# Altium project SAM_Prototype_0.PrjPcb
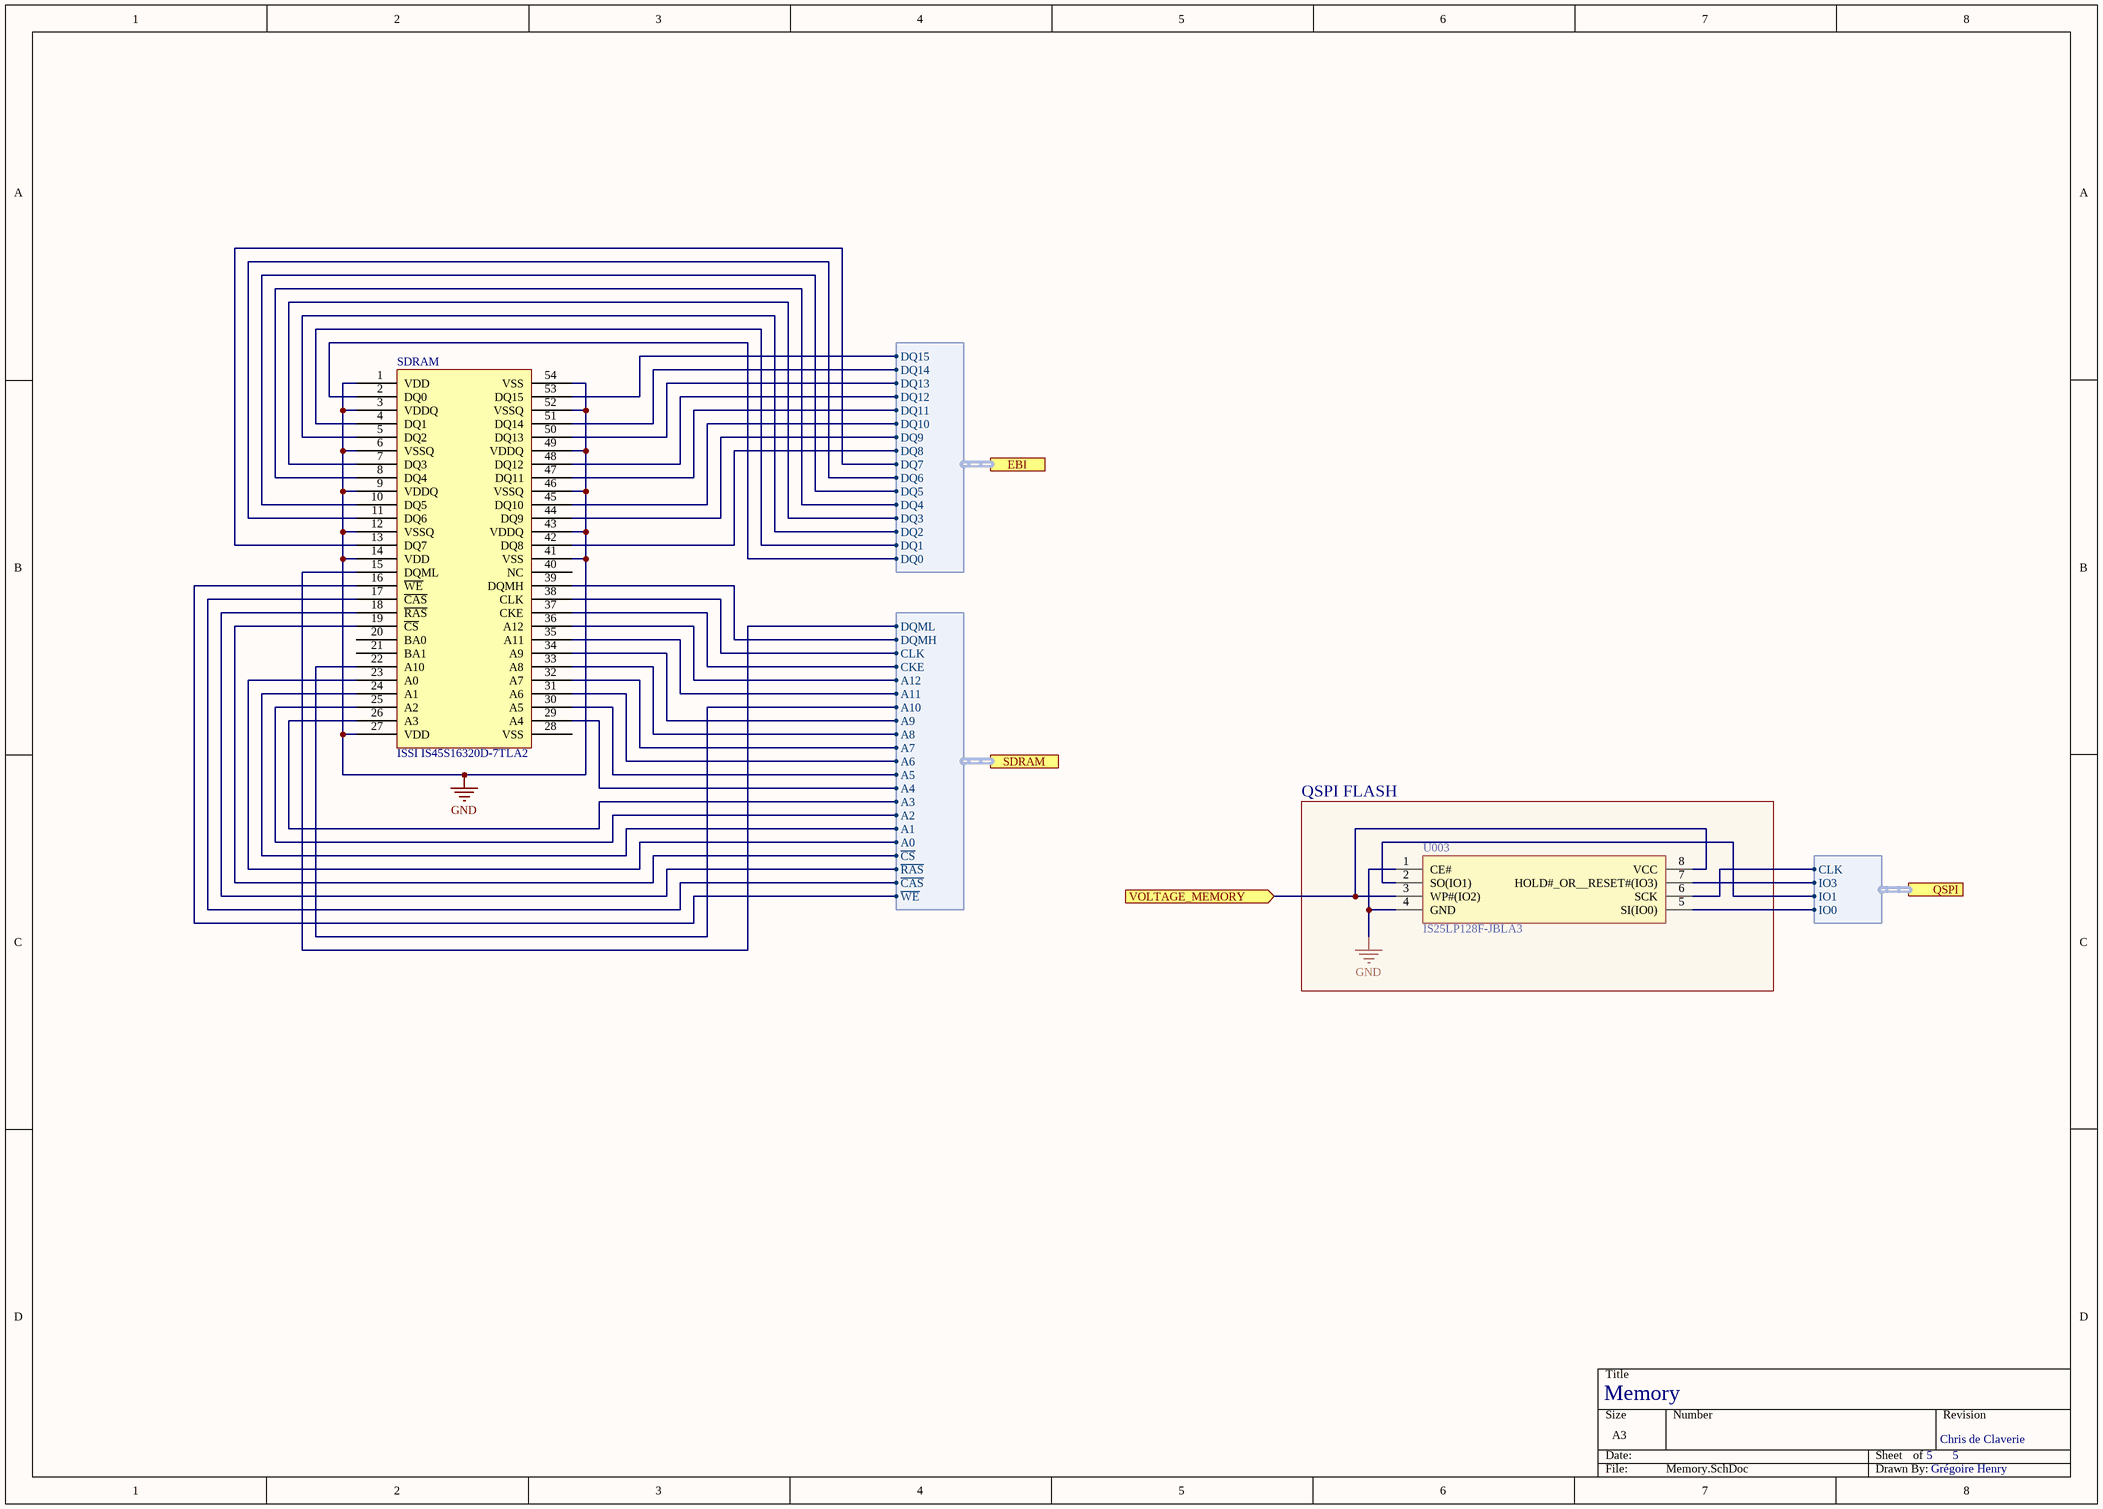
[diagram p0: Memory.SchDoc]
4 sheets, 15 parts. Net scope: global (net labels, ports and power ports of the same name join across sheets).
Sheets:
  Memory.SchDoc
  PowerSupply.SchDoc
  MCU.SchDoc
  TopLevelSchematics.SchDoc

## Sheet Memory.SchDoc
size A3

### Parts
SDRAM  ISSI IS45S16320D-7TLA2  [ISSI IS45S16320D-7TLA2]
U003  IS25LP128F-JBLA3  [SOIC127P790X216-8N]

### Blocks framed on the sheet
QSPI FLASH: U003

### Ports
EBI (harness *), QSPI (harness *), SDRAM (harness *), VOLTAGE_MEMORY (in)

### Harnesses
*: IO1, IO3, CLK, IO0
*: A2, A1, A0, A3, A4, A5, A6, A8, A7, A9, A10, A11, CLK, CKE, ~{CS}, ~{RAS}, ~{CAS}, ~{WE}, DQML, DQMH, A12
*: DQ1, DQ0, DQ2, DQ3, DQ4, DQ5, DQ7, DQ6, DQ8, DQ9, DQ10, DQ13, DQ12, DQ15, DQ14, DQ11

### Nets
GND: SDRAM.1(VDD) SDRAM.3(VDDQ) SDRAM.6(VSSQ) SDRAM.9(VDDQ) SDRAM.12(VSSQ) SDRAM.14(VDD) SDRAM.27(VDD) SDRAM.41(VSS) SDRAM.43(VDDQ) SDRAM.46(VSSQ) SDRAM.49(VDDQ) SDRAM.52(VSSQ) SDRAM.54(VSS) U003.1(CE#) U003.4(GND)
PA12 QIO1: U003.2(SO(IO1)) ; port QSPI.IO1
PA13 QIO0: U003.5(SI(IO0)) ; port QSPI.IO0
PA14 QSCK: U003.6(SCK) ; port QSPI.CLK
PD31 QIO3: U003.7(HOLD#_OR__RESET#(IO3)) ; port QSPI.IO3
VOLTAGE_MCU: U003.3(WP#(IO2)) U003.8(VCC) ; port VOLTAGE_MEMORY
NetSDRAM_2: SDRAM.2(DQ0) ; port EBI.DQ0
NetSDRAM_4: SDRAM.4(DQ1) ; port EBI.DQ1
NetSDRAM_5: SDRAM.5(DQ2) ; port EBI.DQ2
NetSDRAM_7: SDRAM.7(DQ3) ; port EBI.DQ3
NetSDRAM_8: SDRAM.8(DQ4) ; port EBI.DQ4
NetSDRAM_10: SDRAM.10(DQ5) ; port EBI.DQ5
NetSDRAM_11: SDRAM.11(DQ6) ; port EBI.DQ6
NetSDRAM_13: SDRAM.13(DQ7) ; port EBI.DQ7
NetSDRAM_15: SDRAM.15(DQML) ; port SDRAM.DQML
NetSDRAM_16: SDRAM.16(~{WE}) ; port SDRAM.~{WE}
NetSDRAM_17: SDRAM.17(~{CAS}) ; port SDRAM.~{CAS}
NetSDRAM_18: SDRAM.18(~{RAS}) ; port SDRAM.~{RAS}
NetSDRAM_19: SDRAM.19(~{CS}) ; port SDRAM.~{CS}
NetSDRAM_22: SDRAM.22(A10) ; port SDRAM.A10
NetSDRAM_23: SDRAM.23(A0) ; port SDRAM.A0
NetSDRAM_24: SDRAM.24(A1) ; port SDRAM.A1
NetSDRAM_25: SDRAM.25(A2) ; port SDRAM.A2
NetSDRAM_26: SDRAM.26(A3) ; port SDRAM.A3
NetSDRAM_29: SDRAM.29(A4) ; port SDRAM.A4
NetSDRAM_30: SDRAM.30(A5) ; port SDRAM.A5
NetSDRAM_31: SDRAM.31(A6) ; port SDRAM.A6
NetSDRAM_32: SDRAM.32(A7) ; port SDRAM.A7
NetSDRAM_33: SDRAM.33(A8) ; port SDRAM.A8
NetSDRAM_34: SDRAM.34(A9) ; port SDRAM.A9
NetSDRAM_35: SDRAM.35(A11) ; port SDRAM.A11
NetSDRAM_36: SDRAM.36(A12) ; port SDRAM.A12
NetSDRAM_37: SDRAM.37(CKE) ; port SDRAM.CKE
NetSDRAM_38: SDRAM.38(CLK) ; port SDRAM.CLK
NetSDRAM_39: SDRAM.39(DQMH) ; port SDRAM.DQMH
NetSDRAM_42: SDRAM.42(DQ8) ; port EBI.DQ8
NetSDRAM_44: SDRAM.44(DQ9) ; port EBI.DQ9
NetSDRAM_45: SDRAM.45(DQ10) ; port EBI.DQ10
NetSDRAM_47: SDRAM.47(DQ11) ; port EBI.DQ11
NetSDRAM_48: SDRAM.48(DQ12) ; port EBI.DQ12
NetSDRAM_50: SDRAM.50(DQ13) ; port EBI.DQ13
NetSDRAM_51: SDRAM.51(DQ14) ; port EBI.DQ14
NetSDRAM_53: SDRAM.53(DQ15) ; port EBI.DQ15

Not connected (* = marked no-connect by the designer): SDRAM 20(BA0) 21(BA1) 28(VSS) 40(NC)

### Notes on the sheet
- Memory
- 5
- Chris de Claverie
- Grégoire Henry

### Library data of the parts
U003 = IS25LP128F-JBLA3: Integrated Circuit; Manufacturer_Name: Integrated Silicon Solution Inc.; Datasheet Link: https://componentsearchengine.com/Datasheets/1/IS25LP128F-JBLA3.pdf; Height: 2.16mm; Mouser Part Number: 870-IS25LP128F-JBLA3; Mouser Price/Stock: https://www.mouser.com/Search/Refine.aspx?Keyword=870-IS25LP128F-JBLA3; Manufacturer_Part_Number: IS25LP128F-JBLA3

## Sheet PowerSupply.SchDoc
size A3
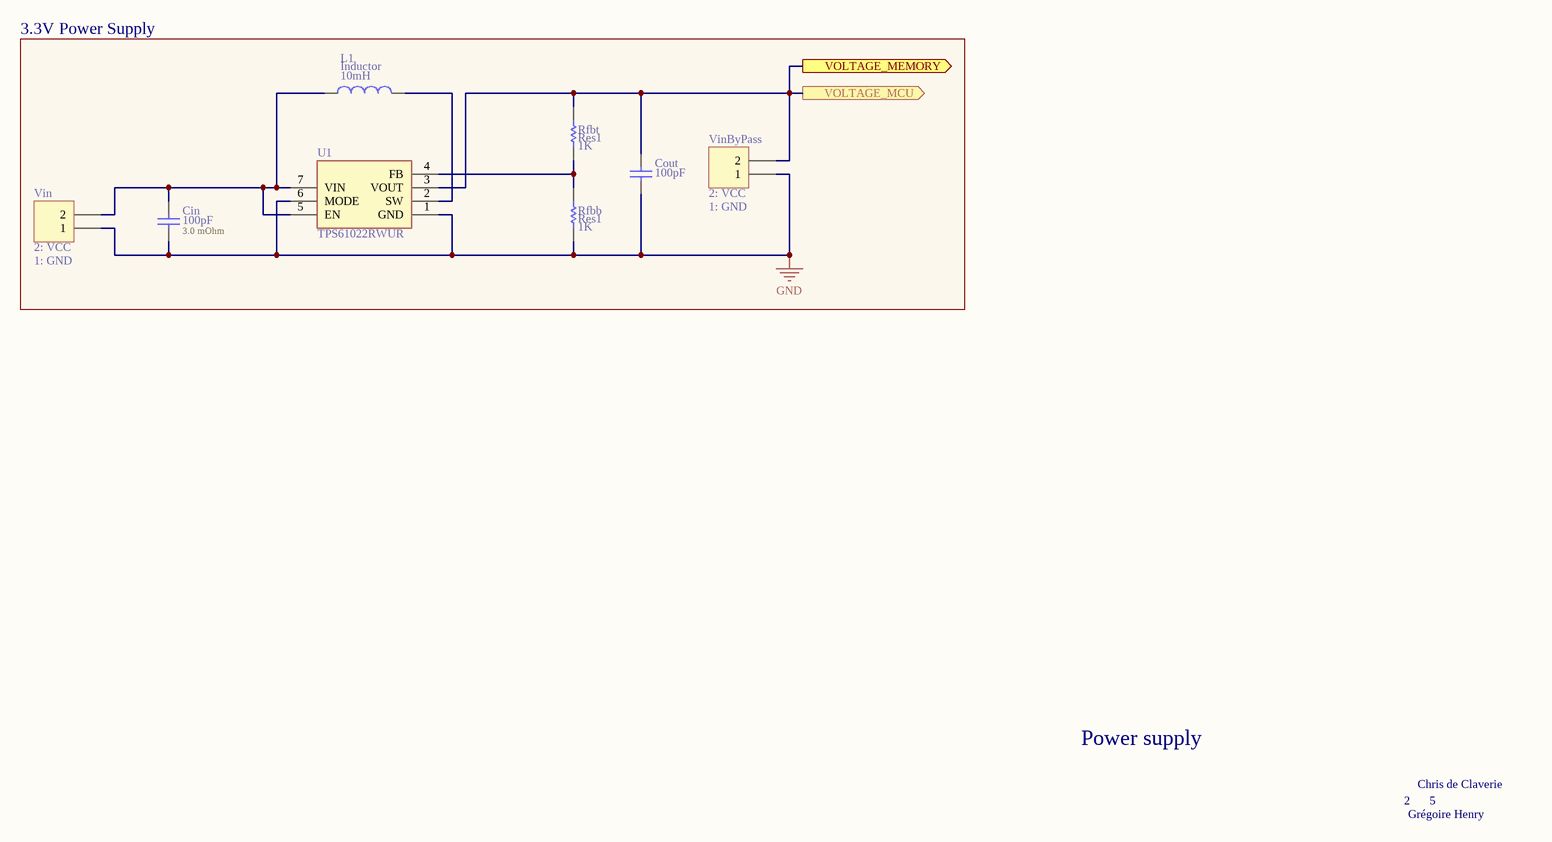
[diagram p1: PowerSupply.SchDoc]

### Parts
Cin  value 100pF  [RAD-0.3]  (hidden comment: Cap)
Cout  value 100pF  [RAD-0.3]  (hidden comment: Cap)
L1  Inductor  value 10mH  [0402-A]
Rfbb  Res1  value 1K  [AXIAL-0.3]
Rfbt  Res1  value 1K  [AXIAL-0.3]
U1  TPS61022RWUR  [TPS61022RWUR]
Vin  Header 2  [HDR1X2]  (value not drawn)
VinByPass  Header 2  [HDR1X2]  (value not drawn)

### Ports
VOLTAGE_MCU (out), VOLTAGE_MEMORY (out)

### Nets
GND: Cin.1 Cout.1 Rfbb.1 U1.1(GND) U1.6(MODE) Vin.1 VinByPass.1
VOLTAGE_MCU: Cout.2 Rfbt.2 U1.3(VOUT) VinByPass.2 ; port VOLTAGE_MCU, port VOLTAGE_MEMORY
NetCin_2: Cin.2 L1.1 U1.5(EN) U1.7(VIN) Vin.2
NetL1_2: L1.2 U1.2(SW)
NetRfbb_2: Rfbb.2 Rfbt.1 U1.4(FB)

### Notes on the sheet
- 3.3V Power Supply
- (near VinByPass) 2: VCC
- (near Vin) 2: VCC
- (near Vin) 1: GND
- (near Cin) 3.0 mOhm
- (near VinByPass) 1: GND
- Power supply
- 2
- Chris de Claverie
- 5
- Grégoire Henry

### Library data of the parts
Cin Cout = Cap: Capacitor; Published: 8-Jun-2000; LatestRevisionDate: 17-Jul-2002; LatestRevisionNote: Re-released for DXP Platform.; PackageReference: RAD-0.3; Publisher: Altium Limited; PackageDescription: Radial Cap, Thru-Hole; 2 Leads; 0.3 in Pin Spacing
L1 = Inductor: Code_IEC: 1005; Published: 8-Jun-2000; LatestRevisionDate: 29-May-2009; LatestRevisionNote: IPC-7351 Footprint Added.; PackageReference: 0402-A; Publisher: Altium Limited; PackageDescription: Chip Inductor; Code_JEITA: 0402
Rfbb Rfbt = Res1: Resistor; Published: 8-Jun-2000; LatestRevisionDate: 17-Jul-2002; LatestRevisionNote: Re-released for DXP Platform.; PackageReference: AXIAL-0.3; Publisher: Altium Limited; PackageDescription: Axial Device, Thru-Hole; 2 Leads; 0.3 in Pin Spacing
U1 = TPS61022RWUR: Power Supply; Manufacturer_Name: Texas Instruments; Datasheet Link: http://www.ti.com/lit/gpn/TPS61022; Height: 1mm; Mouser Part Number: 595-TPS61022RWUR; Mouser Price/Stock: https://www.mouser.com/Search/Refine.aspx?Keyword=595-TPS61022RWUR; Manufacturer_Part_Number: TPS61022RWUR
Vin VinByPass = Header 2: Header, 2-Pin; LatestRevisionDate: 17-Jul-2002; LatestRevisionNote: Re-released for DXP Platform.; Publisher: Altium Limited

## Sheet MCU.SchDoc
size A3
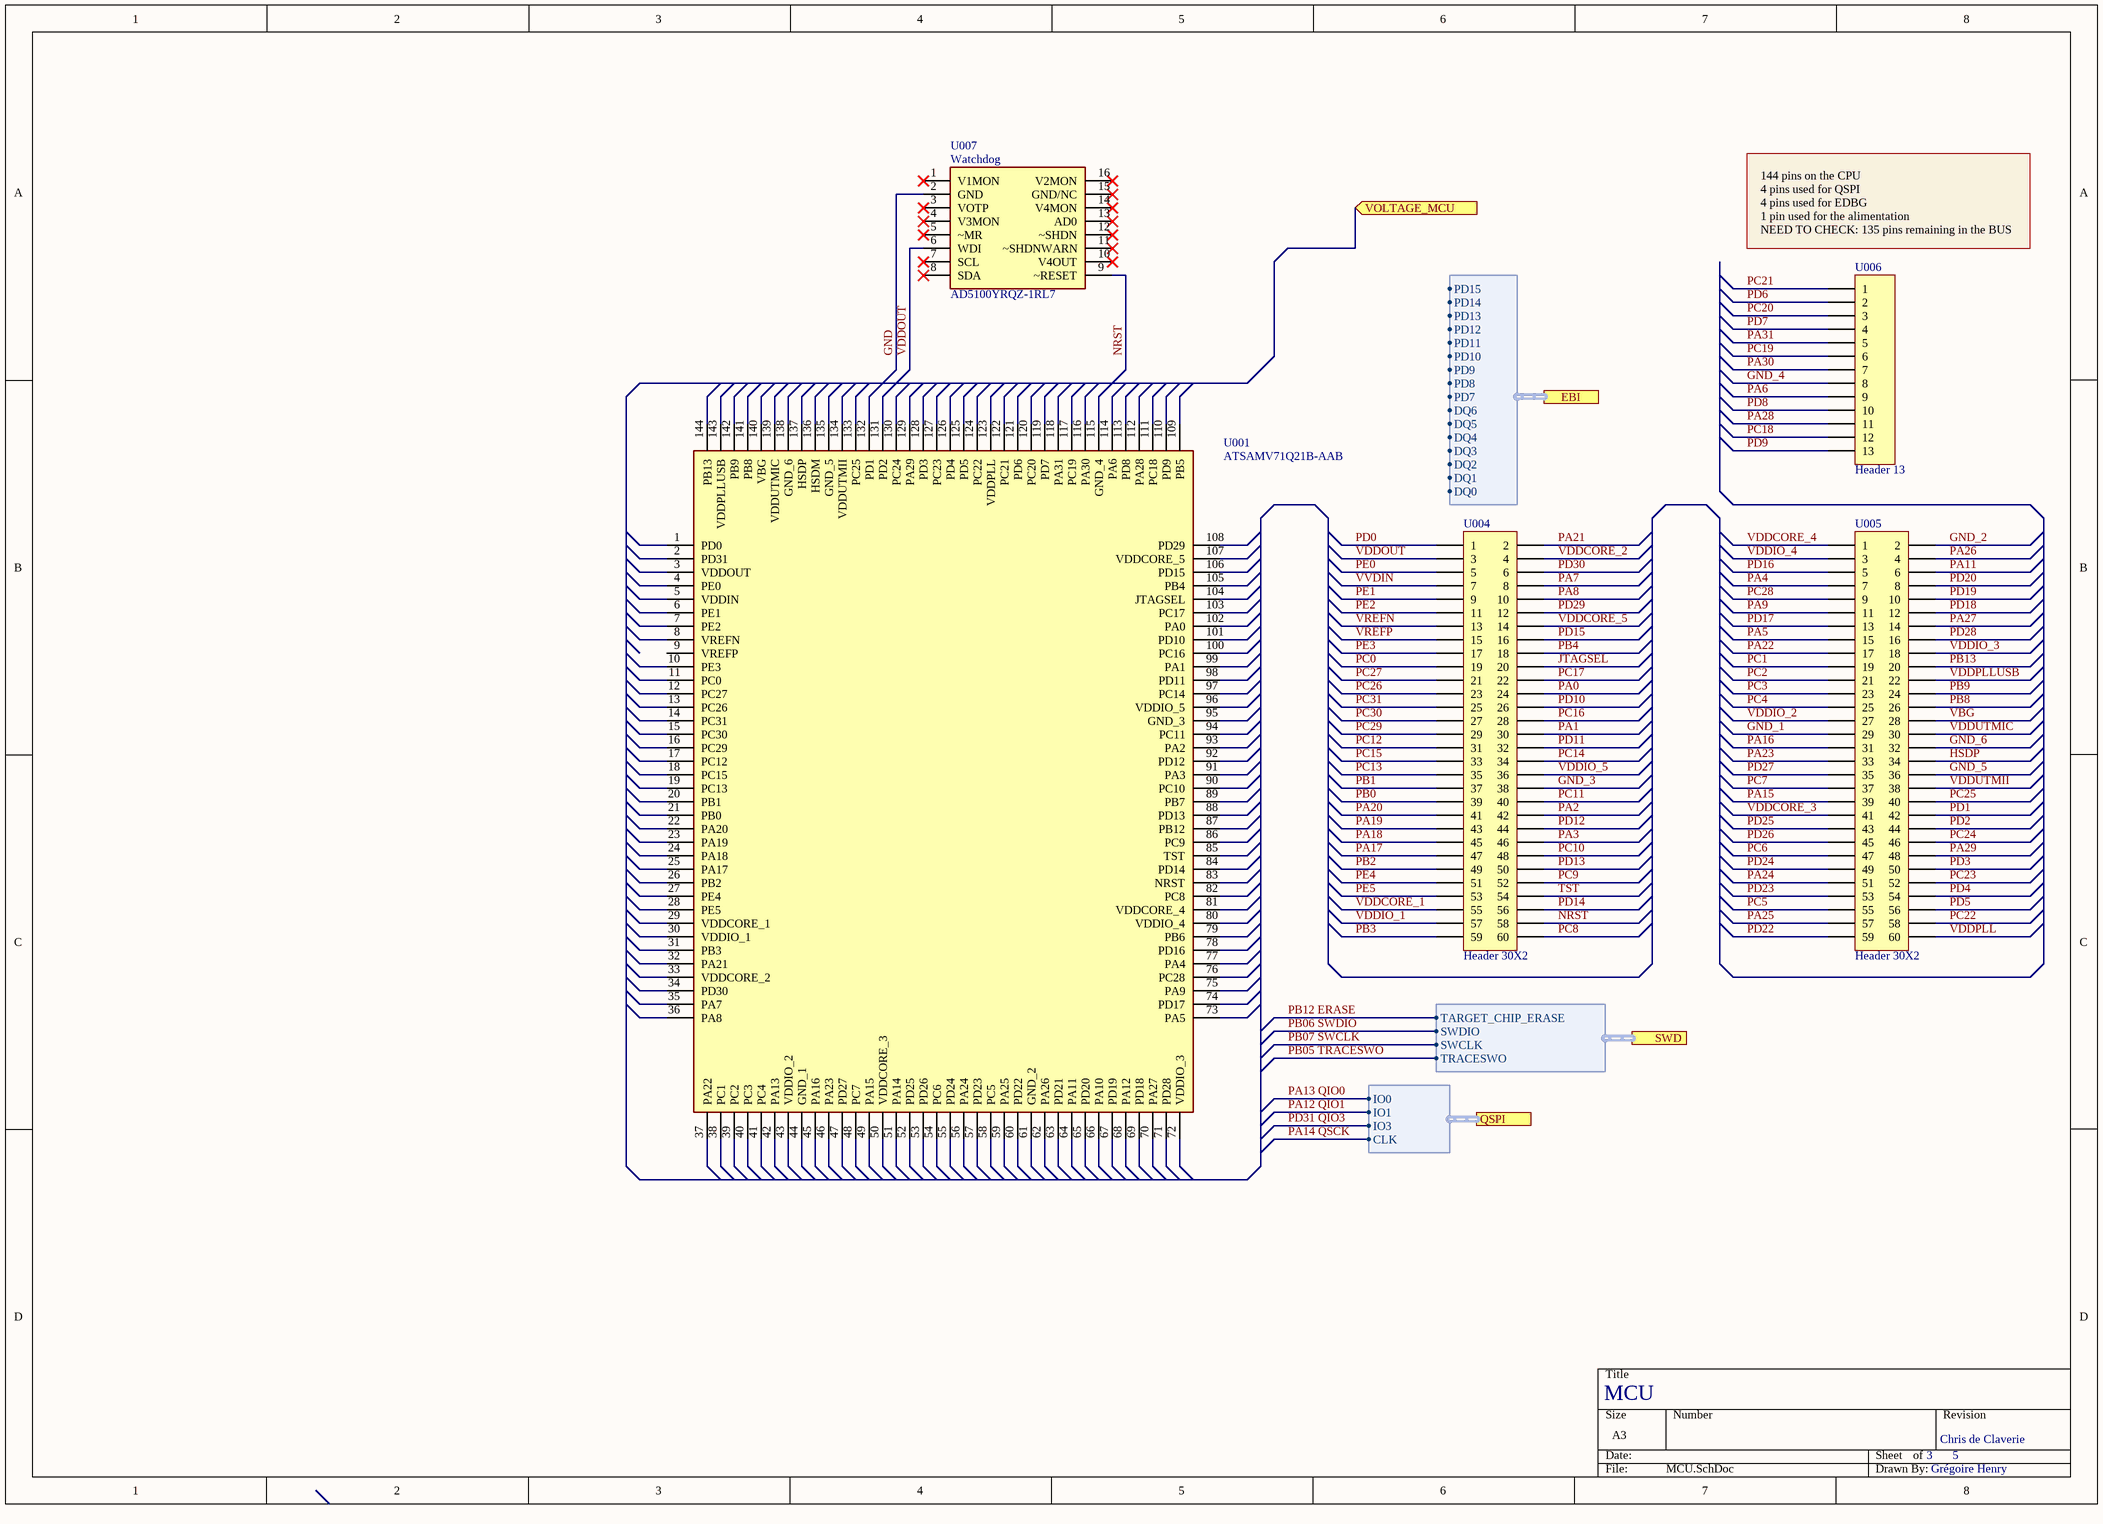
[diagram p2: MCU.SchDoc]

### Parts
U001  ATSAMV71Q21B-AAB  [QFP50P2200X2200X160-144N]
U004  Header 30X2  [HDR2X30]
U005  Header 30X2  [HDR2X30]
U006  Header 13  [HDR1X13]
U007  AD5100YRQZ-1RL7  [SOP65P600X175-16N]

### Ports
EBI (harness *), QSPI (harness *), SWD (harness *), VOLTAGE_MCU (in)

### Harnesses
*: IO0, IO1, IO3, CLK
*: TRACESWO, SWCLK, SWDIO, TARGET_CHIP_ERASE
*: DQ1, DQ0, DQ2, DQ3, DQ4, DQ5, PD7, DQ6, PD8, PD9, PD10, PD13, PD12, PD15, PD14, PD11

### Nets
GND: U007.2(GND)
GND_1: U005.29
GND_2: U005.2
GND_3: U004.38
GND_4: U006.8
GND_5: U005.36
GND_6: U005.32
HSDP: U005.34
JTAGSEL: U004.20
NRST: U004.58 U007.9(~RESET)
PA0: U004.24
PA1: U004.30
PA2: U004.42
PA3: U004.46
PA4: U005.7
PA5: U005.15
PA6: U006.9
PA7: U004.8
PA8: U004.10
PA9: U005.11
PA11: U005.6
PA15: U005.39
PA16: U005.31
PA17: U004.47
PA18: U004.45
PA19: U004.43
PA20: U004.41
PA21: U004.2
PA22: U005.17
PA23: U005.33
PA24: U005.51
PA25: U005.57
PA26: U005.4
PA27: U005.14
PA28: U006.11
PA29: U005.48
PA30: U006.7
PA31: U006.5
PB0: U004.39
PB1: U004.37
PB2: U004.49
PB3: U004.59
PB4: U004.18
PB05 TRACESWO: port SWD.TRACESWO
PB06 SWDIO: port SWD.SWDIO
PB07 SWCLK: port SWD.SWCLK
PB8: U005.26
PB9: U005.24
PB12 ERASE: port SWD.TARGET_CHIP_ERASE
PB13: U005.20
PC0: U004.19
PC1: U005.19
PC2: U005.21
PC3: U005.23
PC4: U005.25
PC5: U005.55
PC6: U005.47
PC7: U005.37
PC8: U004.60
PC9: U004.52
PC10: U004.48
PC11: U004.40
PC12: U004.31
PC13: U004.35
PC14: U004.34
PC15: U004.33
PC16: U004.28
PC17: U004.22
PC18: U006.12
PC19: U006.6
PC20: U006.3
PC21: U006.1
PC22: U005.58
PC23: U005.52
PC24: U005.46
PC25: U005.40
PC26: U004.23
PC27: U004.21
PC28: U005.9
PC29: U004.29
PC30: U004.27
PC31: U004.25
PD0: U004.1
PD1: U005.42
PD2: U005.44
PD3: U005.50
PD4: U005.54
PD5: U005.56
PD6: U006.2
PD7: U006.4
PD8: U006.10
PD9: U006.13
PD10: U004.26
PD11: U004.32
PD12: U004.44
PD13: U004.50
PD14: U004.56
PD15: U004.16
PD16: U005.5
PD17: U005.13
PD18: U005.12
PD19: U005.10
PD20: U005.8
PD22: U005.59
PD23: U005.53
PD24: U005.49
PD25: U005.43
PD26: U005.45
PD27: U005.35
PD28: U005.16
PD29: U004.12
PD30: U004.6
PE0: U004.5
PE1: U004.9
PE2: U004.11
PE3: U004.17
PE4: U004.51
PE5: U004.53
TST: U004.54
VBG: U005.28
VDDCORE_1: U004.55
VDDCORE_2: U004.4
VDDCORE_3: U005.41
VDDCORE_4: U005.1
VDDCORE_5: U004.14
VDDIO_1: U004.57
VDDIO_2: U005.27
VDDIO_3: U005.18
VDDIO_4: U005.3
VDDIO_5: U004.36
VDDOUT: U004.3 U007.6(WDI)
VDDPLL: U005.60
VDDPLLUSB: U005.22
VDDUTMIC: U005.30
VDDUTMII: U005.38
VREFN: U004.13
VREFP: U004.15
VVDIN: U004.7

Not connected (* = marked no-connect by the designer): U001 1(PD0) 2(PD31) 3(VDDOUT) 4(PE0) 5(VDDIN) 6(PE1) 7(PE2) 8(VREFN) 9(VREFP) 10(PE3) 11(PC0) 12(PC27) 13(PC26) 14(PC31) 15(PC30) 16(PC29) 17(PC12) 18(PC15) 19(PC13) 20(PB1) 21(PB0) 22(PA20) 23(PA19) 24(PA18) 25(PA17) 26(PB2) 27(PE4) 28(PE5) 29(VDDCORE_1) 30(VDDIO_1) 31(PB3) 32(PA21) 33(VDDCORE_2) 34(PD30) 35(PA7) 36(PA8) 37(PA22) 38(PC1) 39(PC2) 40(PC3) 41(PC4) 42(PA13) 43(VDDIO_2) 44(GND_1) 45(PA16) 46(PA23) 47(PD27) 48(PC7) 49(PA15) 50(VDDCORE_3) 51(PA14) 52(PD25) 53(PD26) 54(PC6) 55(PD24) 56(PA24) 57(PD23) 58(PC5) 59(PA25) 60(PD22) 61(GND_2) 62(PA26) 63(PD21) 64(PA11) 65(PD20) 66(PA10) 67(PD19) 68(PA12) 69(PD18) 70(PA27) 71(PD28) 72(VDDIO_3) 73(PA5) 74(PD17) 75(PA9) 76(PC28) 77(PA4) 78(PD16) 79(PB6) 80(VDDIO_4) 81(VDDCORE_4) 82(PC8) 83(NRST) 84(PD14) 85(TST) 86(PC9) 87(PB12) 88(PD13) 89(PB7) 90(PC10) 91(PA3) 92(PD12) 93(PA2) 94(PC11) 95(GND_3) 96(VDDIO_5) 97(PC14) 98(PD11) 99(PA1) 100(PC16) 101(PD10) 102(PA0) 103(PC17) 104(JTAGSEL) 105(PB4) 106(PD15) 107(VDDCORE_5) 108(PD29) 109(PB5) 110(PD9) 111(PC18) 112(PA28) 113(PD8) 114(PA6) 115(GND_4) 116(PA30) 117(PC19) 118(PA31) 119(PD7) 120(PC20) 121(PD6) 122(PC21) 123(VDDPLL) 124(PC22) 125(PD5) 126(PD4) 127(PC23) 128(PD3) 129(PA29) 130(PC24) 131(PD2) 132(PD1) 133(PC25) 134(VDDUTMII) 135(GND_5) 136(HSDM) 137(HSDP) 138(GND_6) 139(VDDUTMIC) 140(VBG) 141(PB8) 142(PB9) 143(VDDPLLUSB) 144(PB13); U007 1(V1MON)* 3(VOTP)* 4(V3MON)* 5(~MR)* 7(SCL)* 8(SDA)* 10(V4OUT)* 11(~SHDNWARN)* 12(~SHDN)* 13(AD0)* 14(V4MON)* 15(GND/NC)* 16(V2MON)*

### Notes on the sheet
- (near U007) Watchdog
- (near U006) 144 pins on the CPU
  4 pins used for QSPI
  4 pins used for EDBG
  1 pin used for the alimentation
  NEED TO CHECK: 135 pins remaining in the BUS
- MCU
- 3
- Chris de Claverie
- 5
- Grégoire Henry

### Library data of the parts
U001 = ATSAMV71Q21B-AAB: Integrated Circuit; Manufacturer_Name: Microchip; Datasheet Link: https://componentsearchengine.com/Datasheets/1/ATSAMV71Q21B-AAB.pdf; Height: 1.6mm; Mouser Part Number: 579-ATSAMV71Q21B-AAB; Mouser Price/Stock: https://www.mouser.com/Search/Refine.aspx?Keyword=579-ATSAMV71Q21B-AAB; Manufacturer_Part_Number: ATSAMV71Q21B-AAB
U004 U005 = Header 30X2: Header, 30-Pin, Dual row; LatestRevisionDate: 17-Jul-2002; LatestRevisionNote: Re-released for DXP Platform.; Publisher: Altium Limited
U006 = Header 13: Header, 13-Pin; LatestRevisionDate: 17-Jul-2002; LatestRevisionNote: Re-released for DXP Platform.; Publisher: Altium Limited
U007 = AD5100YRQZ-1RL7: Integrated Circuit; Manufacturer_Name: Analog Devices; Datasheet Link: https://componentsearchengine.com/Datasheets/1/AD5100YRQZ-1RL7.pdf; Mouser Part Number: 584-AD5100YRQZ-1R7; Mouser Price/Stock: https://www.mouser.com/Search/Refine.aspx?Keyword=584-AD5100YRQZ-1R7; Manufacturer_Part_Number: AD5100YRQZ-1RL7

## Sheet TopLevelSchematics.SchDoc: SAM
size A3; Author: Grégoire Henry; DrawnBy: Grégoire Henry; Organization: IPSA ONE; SheetNumber: 1; SheetTotal: 5
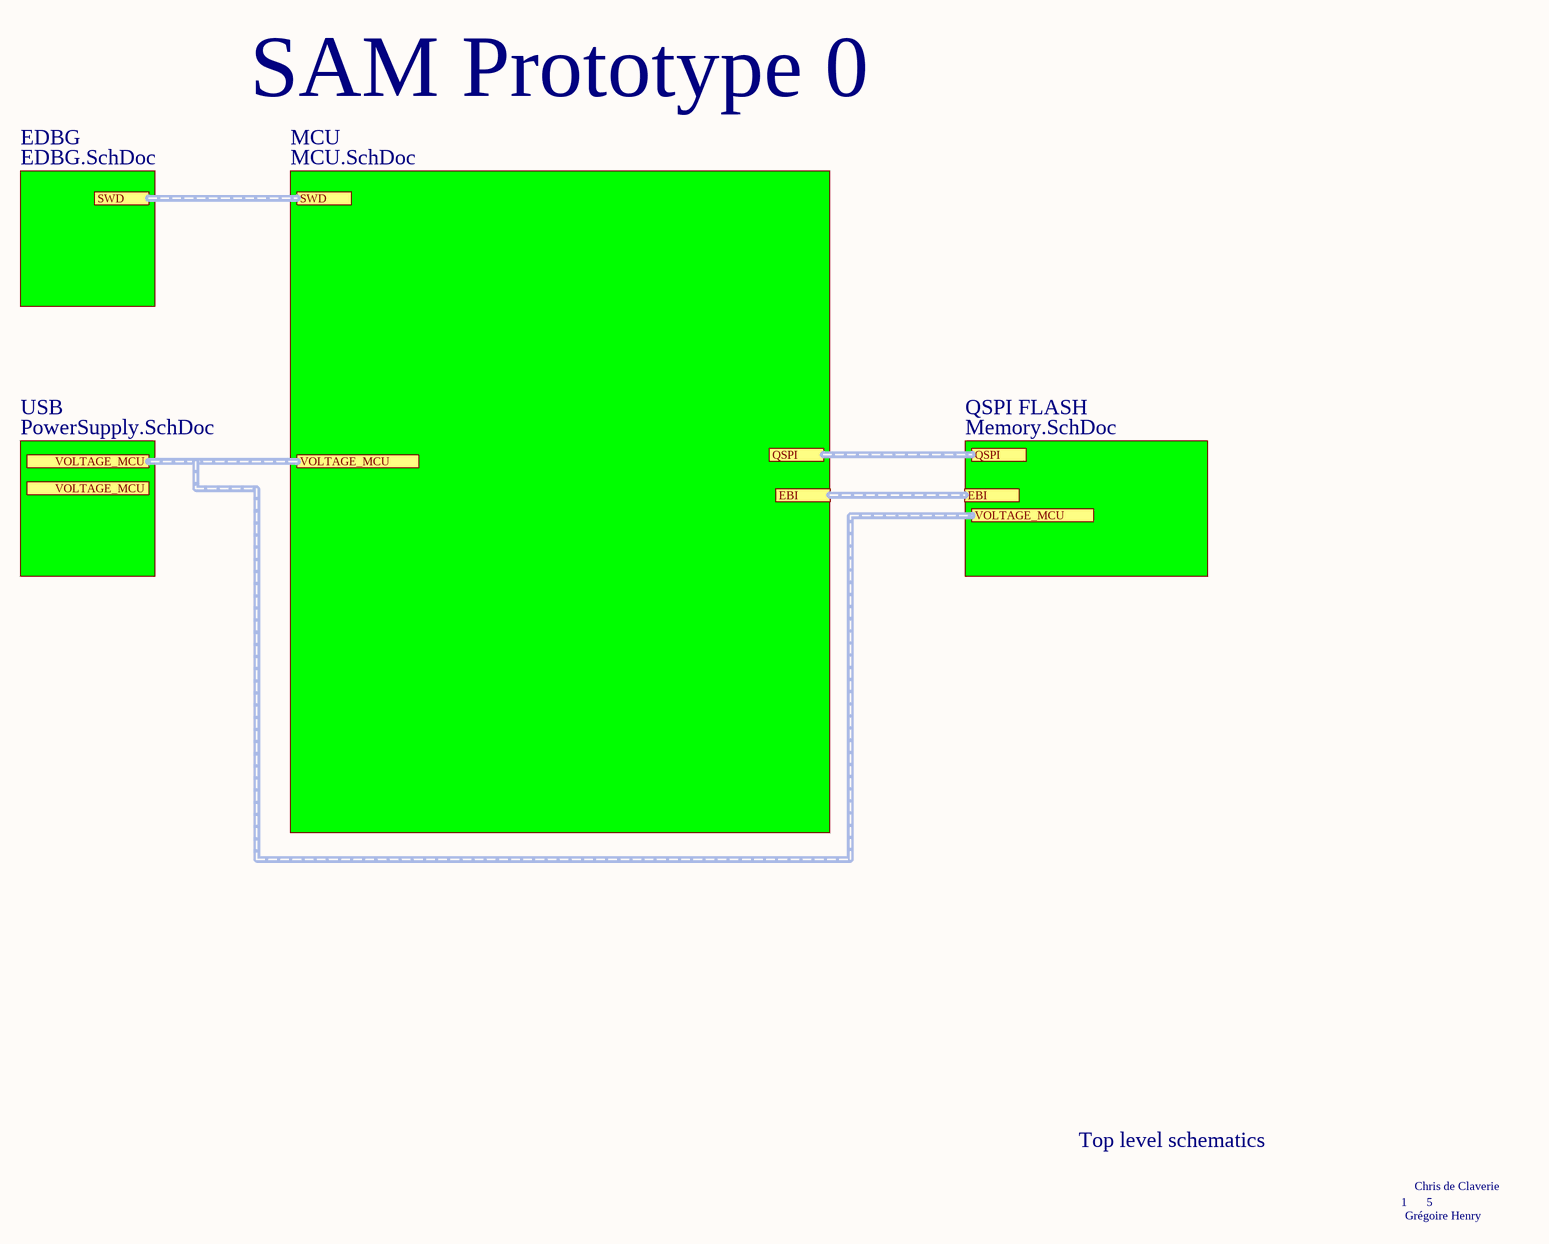
[diagram p3: TopLevelSchematics.SchDoc]

### Ports
EBI (harness *), QSPI (harness *), SWD (harness *), VOLTAGE_MCU (harness *)

### Notes on the sheet
- SAM Prototype 0
- EDBG.SchDoc
- EDBG
- MCU.SchDoc
- MCU
- PowerSupply.SchDoc
- USB
- Memory.SchDoc
- QSPI FLASH
- Top level schematics
- 1
- Chris de Claverie
- 5
- Grégoire Henry

## Nets that join several sheets
GND: Memory (15 pins), PowerSupply (7 pins), MCU (U007.2)
VOLTAGE_MCU: Memory (U003.3 U003.8), PowerSupply (Cout.2 Rfbt.2 U1.3 VinByPass.2)